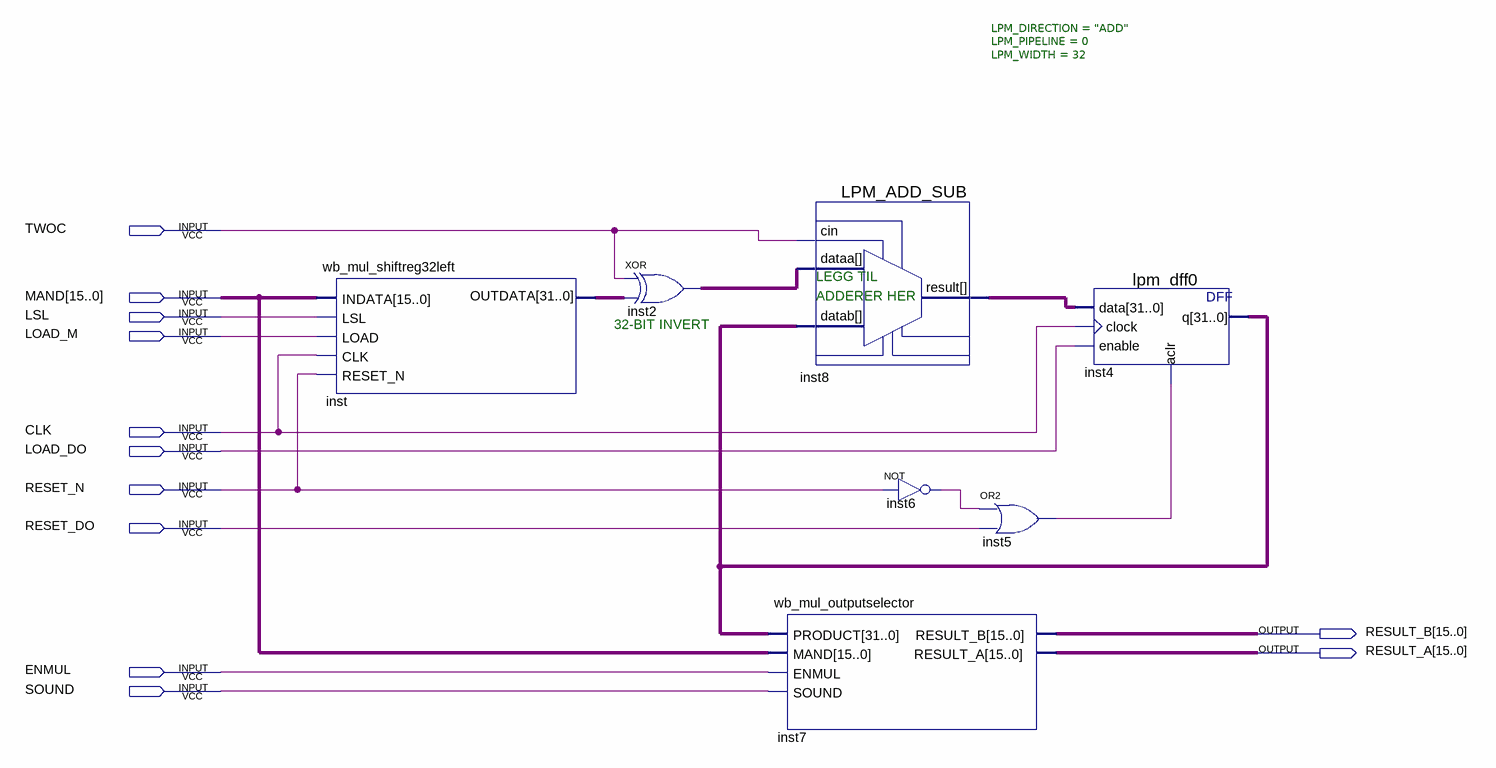
[diagram p0: schematic sheet]
// Quartus schematic mul_data_path.bdf as structural Verilog: 7 symbols, 12 pins
module mul_data_path (
  input  TWOC,
  input  [15:0] MAND,
  input  LSL,
  input  LOAD_M,
  input  CLK,
  input  LOAD_DO,
  input  RESET_N,
  input  RESET_DO,
  input  ENMUL,
  input  SOUND,
  output [15:0] RESULT_B,
  output [15:0] RESULT_A
);

  wire inst5_out, inst6_out;
  wire [31:0] inst2_out, inst4_q, inst8_result, inst_outdata;

  wb_mul_shiftreg32left inst (
    .INDATA(MAND), .LSL(LSL), .CLK(CLK), .RESET_N(RESET_N), .LOAD(LOAD_M), .OUTDATA(inst_outdata));
  assign inst2_out = {32{TWOC}} ^ inst_outdata;  // XOR inst2, 32 bits wide
  wb_mul_outputselector inst7 (
    .PRODUCT(inst4_q), .MAND(MAND), .ENMUL(ENMUL), .SOUND(SOUND), .RESULT_B(RESULT_B), .RESULT_A(RESULT_A));
  LPM_ADD_SUB #(.LPM_DIRECTION("ADD"), .LPM_PIPELINE(0), .LPM_WIDTH(32)) inst8 (
    .cin(TWOC), .dataa(inst2_out), .datab(inst4_q), .result(inst8_result));
  not inst6 (inst6_out, RESET_N);
  or inst5 (inst5_out, inst6_out, RESET_DO);
  lpm_dff0 inst4 (.data(inst8_result), .clock(CLK), .enable(LOAD_DO), .aclr(inst5_out), .q(inst4_q));

  // Notes on the sheet:
  //   LEGG TIL
  //   ADDERER HER
  //   32-BIT INVERT
endmodule
